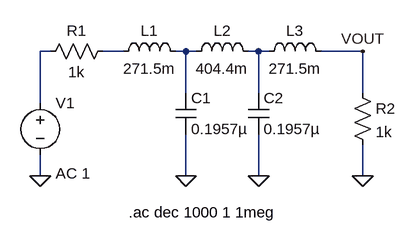
[diagram p0: schematic fig-02-07-09.asc]
fig-02-07-09.asc, the LTspice schematic file:
Version 4
SHEET 1 880 680
WIRE 128 48 112 48
WIRE 240 48 208 48
WIRE 336 48 320 48
WIRE 352 48 336 48
WIRE 448 48 432 48
WIRE 464 48 448 48
WIRE 608 48 544 48
WIRE 336 112 336 48
WIRE 448 112 448 48
WIRE 608 112 608 48
WIRE 112 128 112 48
WIRE 112 240 112 208
WIRE 336 240 336 176
WIRE 448 240 448 176
WIRE 608 240 608 192
FLAG 112 240 0
FLAG 336 240 0
FLAG 448 240 0
FLAG 608 240 0
FLAG 608 48 VOUT
SYMBOL voltage 112 112 R0
WINDOW 123 24 124 Left 2
WINDOW 39 0 0 Left 0
SYMATTR Value2 AC 1
SYMATTR InstName V1
SYMATTR Value ""
SYMBOL res 224 32 R90
WINDOW 0 0 56 VBottom 2
WINDOW 3 32 56 VTop 2
SYMATTR InstName R1
SYMATTR Value 1k
SYMBOL ind 224 64 R270
WINDOW 0 32 56 VTop 2
WINDOW 3 5 56 VBottom 2
SYMATTR InstName L1
SYMATTR Value 271.5m
SYMBOL ind 336 64 R270
WINDOW 0 32 56 VTop 2
WINDOW 3 5 56 VBottom 2
SYMATTR InstName L2
SYMATTR Value 404.4m
SYMBOL ind 448 64 R270
WINDOW 0 32 56 VTop 2
WINDOW 3 5 56 VBottom 2
SYMATTR InstName L3
SYMATTR Value 271.5m
SYMBOL cap 320 112 R0
SYMATTR InstName C1
SYMATTR Value 0.1957µ
SYMBOL cap 432 112 R0
SYMATTR InstName C2
SYMATTR Value 0.1957µ
SYMBOL res 592 96 R0
SYMATTR InstName R2
SYMATTR Value 1k
TEXT 248 296 Left 2 !.ac dec 1000 1 1meg

The netlist it stands for:
* fig-02-07-09.asc
V1 N001 0 AC 1
R1 N002 N001 1k
L1 N002 N003 271.5m
L2 N003 N004 404.4m
L3 N004 VOUT 271.5m
C1 N003 0 0.1957µ
C2 N004 0 0.1957µ
R2 VOUT 0 1k
.ac dec 1000 1 1meg
.backanno
.end